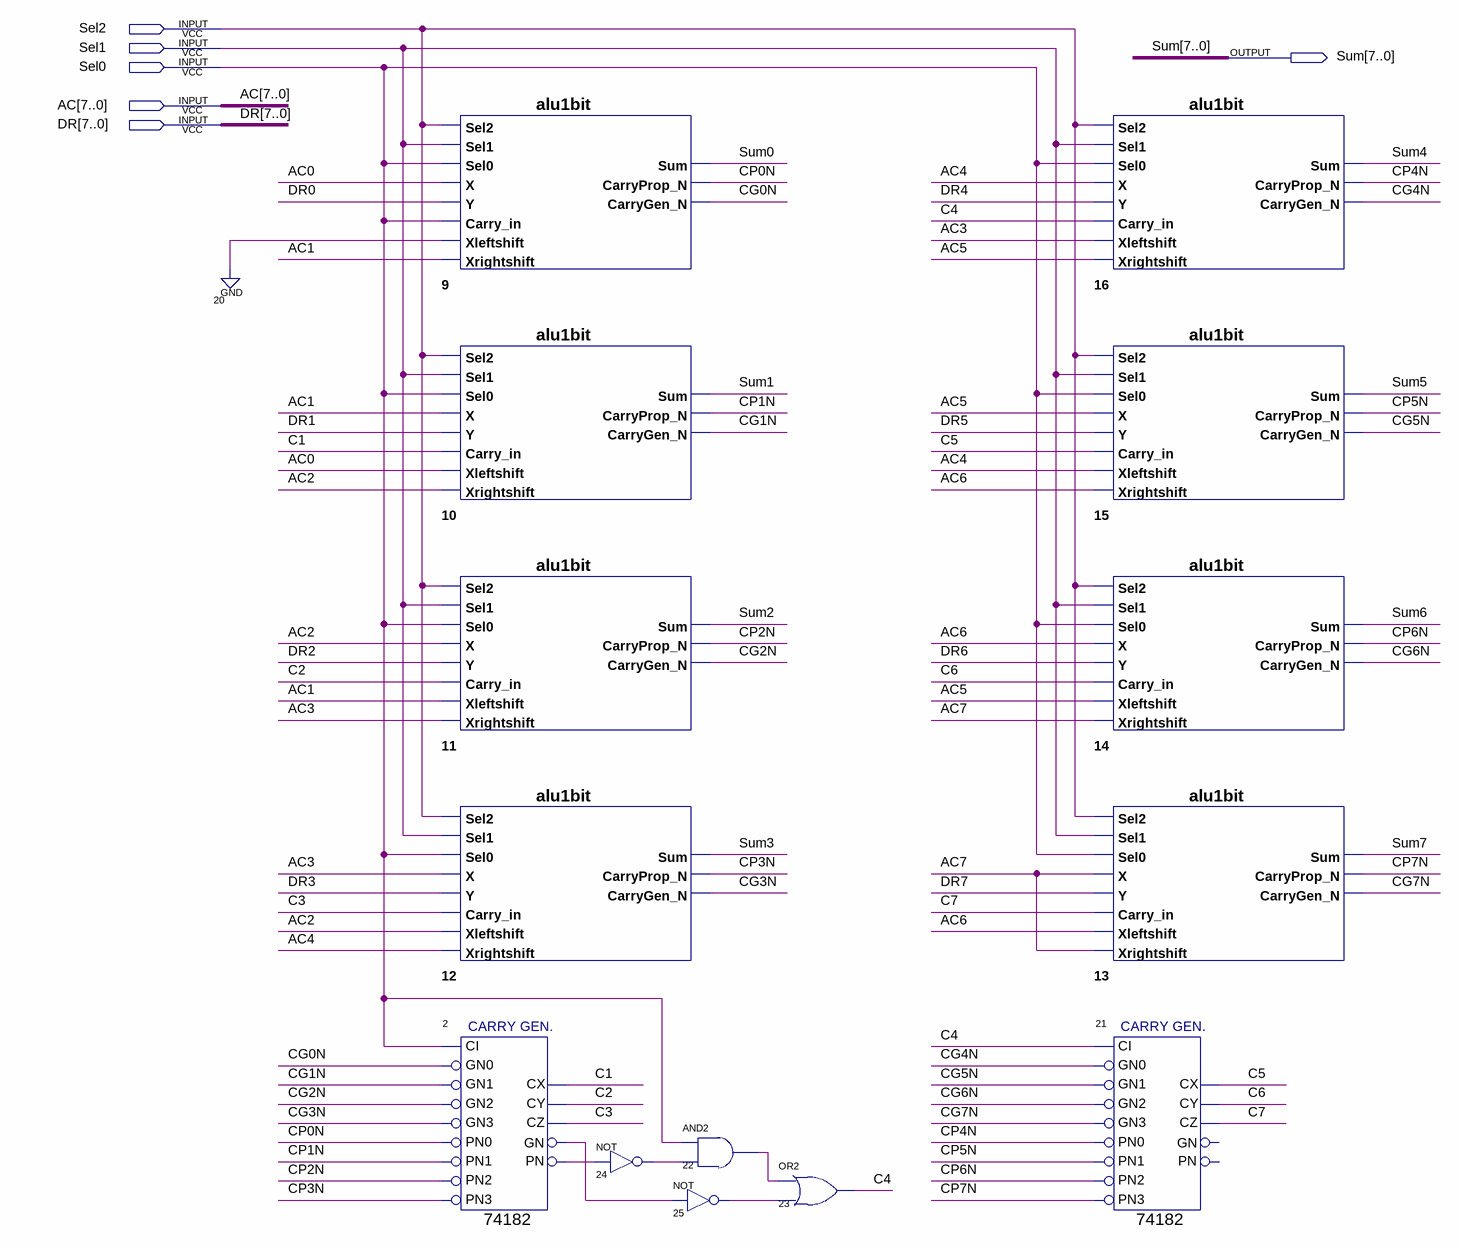
[diagram p0: schematic sheet]
// Quartus schematic alu8bits.bdf as structural Verilog: 14 symbols, 6 pins
module alu8bits (
  input  Sel2,
  input  Sel1,
  input  Sel0,
  input  [7:0] AC,
  input  [7:0] DR,
  output [7:0] Sum
);

  wire C1, C2, C3, C4, C5, C6, C7, CG0N, CG1N, CG2N, CG3N, CG4N, CG5N, CG6N, CG7N, CP0N, CP1N, CP2N, CP3N,
       CP4N, CP5N, CP6N, CP7N, n2_gn, n2_pn, n22_out, n24_out, n25_out;

  alu1bit u_9 (
    .Sel2(Sel2), .Sel1(Sel1), .Sel0(Sel0), .X(AC[0]), .Y(DR[0]), .Carry_in(Sel0), .Xleftshift(1'b0),
    .Xrightshift(AC[1]), .Sum(Sum[0]), .CarryProp_N(CP0N), .CarryGen_N(CG0N));
  alu1bit u_10 (
    .Sel2(Sel2), .Sel1(Sel1), .Sel0(Sel0), .X(AC[1]), .Y(DR[1]), .Carry_in(C1), .Xleftshift(AC[0]),
    .Xrightshift(AC[2]), .Sum(Sum[1]), .CarryProp_N(CP1N), .CarryGen_N(CG1N));
  alu1bit u_11 (
    .Sel2(Sel2), .Sel1(Sel1), .Sel0(Sel0), .X(AC[2]), .Y(DR[2]), .Carry_in(C2), .Xleftshift(AC[1]),
    .Xrightshift(AC[3]), .Sum(Sum[2]), .CarryProp_N(CP2N), .CarryGen_N(CG2N));
  alu1bit u_12 (
    .Sel2(Sel2), .Sel1(Sel1), .Sel0(Sel0), .X(AC[3]), .Y(DR[3]), .Carry_in(C3), .Xleftshift(AC[2]),
    .Xrightshift(AC[4]), .Sum(Sum[3]), .CarryProp_N(CP3N), .CarryGen_N(CG3N));
  \74182  u_2 (
    .PN2(CP2N), .PN3(CP3N), .GN2(CG2N), .GN3(CG3N), .PN0(CP0N), .PN1(CP1N), .CI(Sel0), .GN0(CG0N),
    .GN1(CG1N), .CY(C2), .CZ(C3), .CX(C1), .PN(n2_pn), .GN(n2_gn));
  not u_24 (n24_out, n2_pn);
  and u_22 (n22_out, Sel0, n24_out);
  not u_25 (n25_out, n2_gn);
  or u_23 (C4, n22_out, n25_out);
  alu1bit u_16 (
    .Sel2(Sel2), .Sel1(Sel1), .Sel0(Sel0), .X(AC[4]), .Y(DR[4]), .Carry_in(C4), .Xleftshift(AC[3]),
    .Xrightshift(AC[5]), .Sum(Sum[4]), .CarryProp_N(CP4N), .CarryGen_N(CG4N));
  alu1bit u_15 (
    .Sel2(Sel2), .Sel1(Sel1), .Sel0(Sel0), .X(AC[5]), .Y(DR[5]), .Carry_in(C5), .Xleftshift(AC[4]),
    .Xrightshift(AC[6]), .Sum(Sum[5]), .CarryProp_N(CP5N), .CarryGen_N(CG5N));
  alu1bit u_14 (
    .Sel2(Sel2), .Sel1(Sel1), .Sel0(Sel0), .X(AC[6]), .Y(DR[6]), .Carry_in(C6), .Xleftshift(AC[5]),
    .Xrightshift(AC[7]), .Sum(Sum[6]), .CarryProp_N(CP6N), .CarryGen_N(CG6N));
  alu1bit u_13 (
    .Sel2(Sel2), .Sel1(Sel1), .Sel0(Sel0), .X(AC[7]), .Y(DR[7]), .Carry_in(C7), .Xleftshift(AC[6]),
    .Xrightshift(AC[7]), .Sum(Sum[7]), .CarryProp_N(CP7N), .CarryGen_N(CG7N));
  \74182  u_21 (
    .PN2(CP6N), .PN3(CP7N), .GN2(CG6N), .GN3(CG7N), .PN0(CP4N), .PN1(CP5N), .CI(C4), .GN0(CG4N), .GN1(CG5N),
    .CY(C6), .CZ(C7), .CX(C5));  // open: PN, GN
endmodule
